# Altium schematic sheet DETECTOR.SchDoc
size A4; SheetNumber: 7; SheetTotal: 13
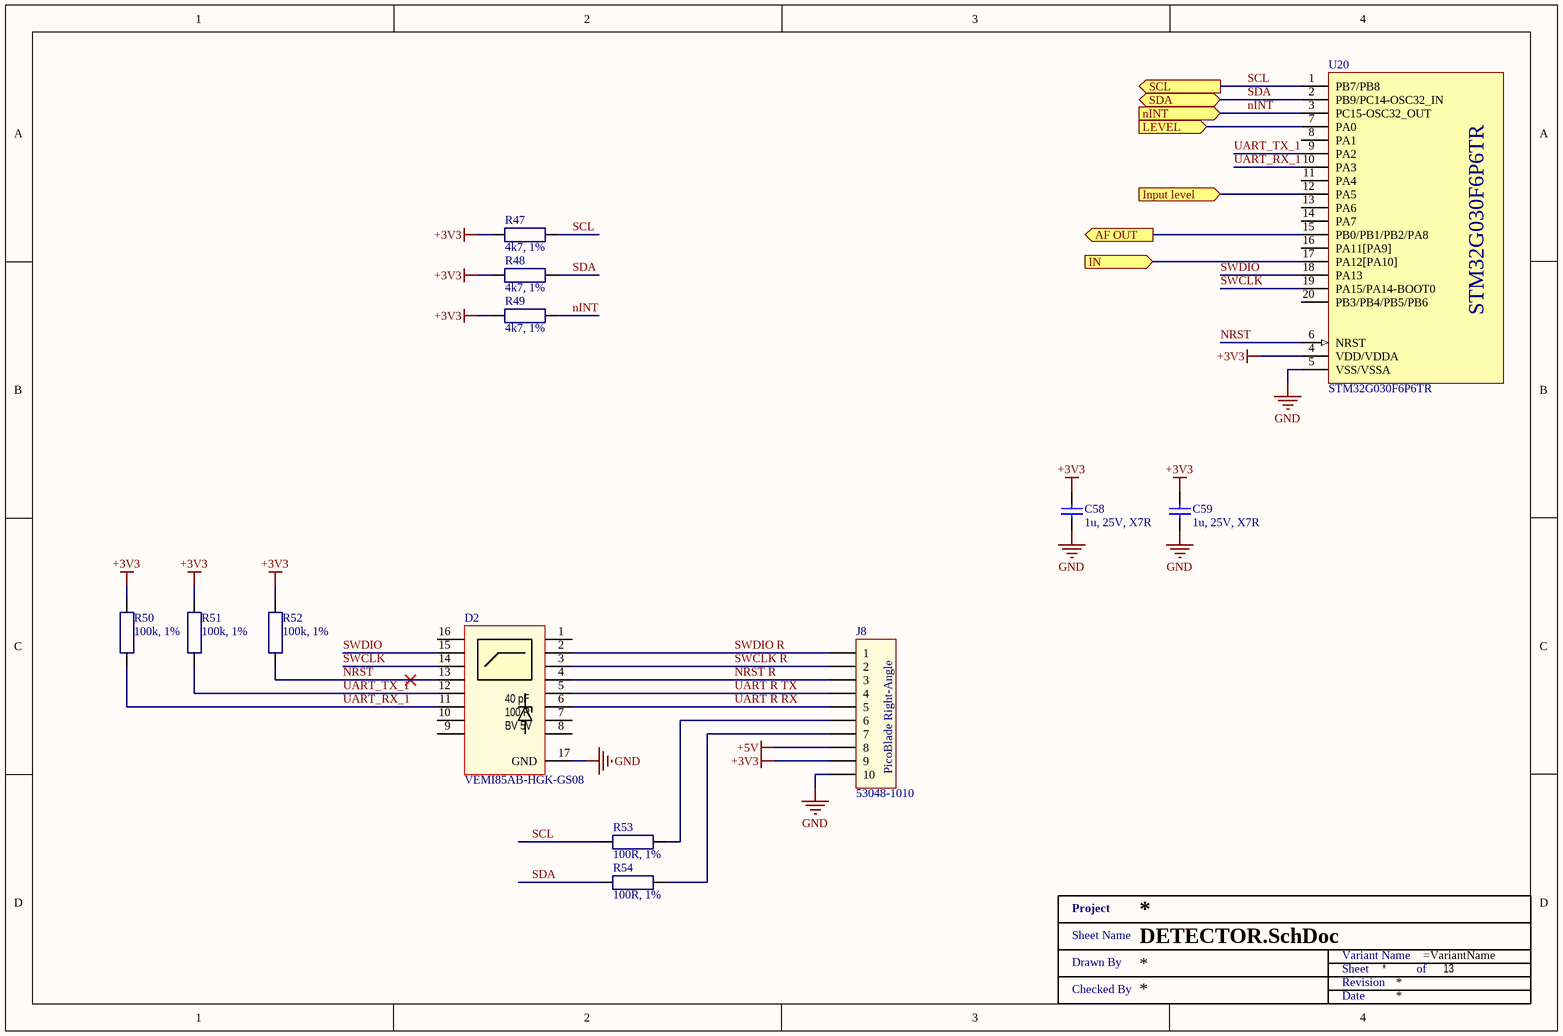
[diagram p0: DETECTOR.SchDoc]

## Parts
C58  1u, 25V, X7R  [SMD0603]
C59  1u, 25V, X7R  [SMD0603]
D2  VEMI85AB-HGK-GS08  [LLP3313-17L]
J8  53048-1010  [530481010]
R47  4k7, 1%  [SMD0603 - R]
R48  4k7, 1%  [SMD0603 - R]
R49  4k7, 1%  [SMD0603 - R]
R50  100k, 1%  [SMD0603 - R]
R51  100k, 1%  [SMD0603 - R]
R52  100k, 1%  [SMD0603 - R]
R53  100R, 1%  [SMD0603 - R]
R54  100R, 1%  [SMD0603 - R]
U20  STM32G030F6P6TR  [TSSOP20]
XX?  Title 1  (value not drawn)  (graphical)

## Ports
AF OUT (out), IN (in), Input level (in), LEVEL (in), nINT (in), SCL (out), SDA (bidir)

## Nets
+3V3: C58.2 C59.2 J8.9 R47.1 R48.1 R49.1 R50.2 R51.2 R52.2 U20.4(VDD/VDDA)
+5V: J8.8
GND: C58.1 C59.1 D2.17(GND) J8.10 U20.5(VSS/VSSA)
AF OUT: U20.15(PB0/PB1/PB2/PA8) ; port AF OUT
IN: U20.17(PA12[PA10]) ; port IN
Input level: U20.12(PA5) ; port Input level
LEVEL: U20.7(PA0) ; port LEVEL
nINT: R49.2 U20.3(PC15-OSC32_OUT) ; port nINT
NRST: D2.13 R52.1 U20.6(NRST)
NRST R: D2.4 J8.3
SCL: R47.2 R53.1 U20.1(PB7/PB8) ; port SCL
SDA: R48.2 R54.1 U20.2(PB9/PC14-OSC32_IN) ; port SDA
SWCLK: D2.14 U20.19(PA15/PA14-BOOT0)
SWCLK R: D2.3 J8.2
SWDIO: D2.15 U20.18(PA13)
SWDIO R: D2.2 J8.1
UART R RX: D2.6 J8.5
UART R TX: D2.5 J8.4
UART_RX_1: D2.11 R50.1 U20.10(PA3)
UART_TX_1: D2.12 R51.1 U20.9(PA2)
NetJ8_6: J8.6 R53.2
NetJ8_7: J8.7 R54.2

Not connected (* = marked no-connect by the designer): D2 1 7 8 9 10 16; U20 8(PA1) 11(PA4) 13(PA6) 14(PA7) 16(PA11[PA9]) 20(PB3/PB4/PB5/PB6)

## Notes on the sheet
- (in symbol 53048-1010) PicoBlade Right-Angle
- (in symbol Title 1) Project; Sheet Name; Variant Name; Drawn By; Sheet; of; Revision; Checked By; Date
- (in symbol VEMI85AB-HGK-GS08) 40 pF; 100 R; BV 5V

## Library data of the parts
C58 C59 = CGA3E1X7R1E105K080AC: CAP CER 1UF 25V X7R 0603; Manufacturer: TDK Corporation; Tolerance: ±10%; Manufacturer Part Number: CGA3E1X7R1E105K080AC; RoHS: RoHS Compliant; Category: Capacitors; Stock 1: 109509; Pricing 1: 1=0.2, 10=0.135, 100=0.0686, 500=0.04696, 1000=0.04154 (USD); Packaging: Cut Tape (CT); Part Status: Active; Voltage - Rated: 25V; Temperature Coefficient: X7R; Operating Temperature: -55°C ~ 125°C; Features: -; Ratings: AEC-Q200; Applications: Automotive; Failure Rate: -; Mounting Type: Surface Mount, MLCC; Package / Case: 0603 (1608 Metric); Size / Dimension: 0.063" L x 0.032" W (1.60mm x 0.80mm); Height - Seated (Max): -; Thickness (Max): 0.035" (0.90mm); Lead Spacing: -; Lead Style: -; ComponentLink1URL: https://product.tdk.com/info/en/catalog/datasheets/mlcc_automotive_general_en.pdf; ComponentLink1Description: https://product.tdk.com/info/en/catalog/datasheets/mlcc_automotive_general_en.pdf; Capacitance: 1u; Supplier 1: Mouser; Supplier Part Number 1: 810-CGA3E1X7R1E105K; Supplier 2: Farnell; Supplier Part Number 2: 2346962; Supplier 3: Digi-Key; Supplier Part Number 3: 445-6931-1-ND
D2 = VEMI85AB-HGK-GS08: EMI FILTER; Manufacturer: VISHAY; EMI Filter Type: EMI Filter with ESD Protection; No. of Data Lines: 8 Data Lines; Filter Circuit: C-R-C Pi Filter; Filter Case Style: LLP3313; No. of Pins: 17; Clamping Voltage Vc Max: 8; Supplier 1: Mouser; Supplier Part Number 1: 78-VEMI85AB-HGK; Manufacturer Part Number: VEMI85AB-HGK-GS08; RoHS: YES; Stock 1: 9416; Pricing 1: 1=0.563, 25=0.446, 50=0.393, 100=0.339, 250=0.308, 500=0.279 (GBP); Product Range: -; ComponentLink1URL: http://www.farnell.com/datasheets/2244016.pdf; ComponentLink1Description: http://www.farnell.com/datasheets/2244016.pdf; Supplier 2: Farnell; Supplier Part Number 2: 1795412; Supplier 3: Digi-Key; Supplier Part Number 3: 751-1456-2-ND
J8 = 53048-1010: 1.25mm Pitch, PicoBlade PCB Header, Single Row, Right-Angle, Through Hole, Tin (Sn) Plating, Friction Lock, 10 Circuits, Tray, 2.30mm PC Tail Length; Manufacturer: Molex, LLC; Pitch - Mating: 0.049" (1.25mm); Number of Positions: 10; Number of Positions Loaded: All; Style: Board to Cable/Wire; Shrouding: Shrouded - 4 Wall; Contact Length - Post: 0.091" (2.30mm); Material Flammability Rating: UL94 V-0; Manufacturer Part Number: 53048-1010; RoHS: RoHS Compliant; Category: Connectors, Interconnects; Stock 1: 6090; Pricing 1: 1=0.87, 10=0.763, 100=0.6582, 500=0.53856, 1000=0.47872, 5000=0.41888, 10000=0.39794 (USD); Packaging: Tray; Part Status: Active; Connector Type: Header; Contact Type: Male Blade; Number of Rows: 1; Row Spacing - Mating: -; Mounting Type: Through Hole, Right Angle; Termination: Solder; Fastening Type: Detent Lock; Contact Length - Mating: -; Overall Contact Length: -; Insulation Height: 0.138" (3.50mm); Contact Shape: Rectangular; Contact Finish - Mating: Tin; Contact Finish Thickness - Mating: -; Contact Finish - Post: Tin; Contact Material: Phosphor Bronze; Insulation Material: Polyamide (PA), Nylon; Features: -; Operating Temperature: -; Ingress Protection: -; Insulation Color: Natural; Current Rating: -; Voltage Rating: -; Mated Stacking Heights: -; Contact Finish Thickness - Post: -; Applications: Automotive, General Purpose, Industrial, Medical; ComponentLink1URL: http://www.molex.com/pdm_docs/sd/530481010_sd.pdf; ComponentLink1Description: http://www.molex.com/pdm_docs/sd/530481010_sd.pdf; Ucel: Ucel; Supplier 1: Mouser; Supplier Part Number 1: 538-53048-1010; Supplier 2: Digi-Key; Supplier Part Number 2: WM1750-ND; Supplier 3: Farnell; Supplier Part Number 3: 9733108
R47-R49 = CRCW06034K70FKEA: RES SMD 4.7K OHM 1% 1/10W 0603; Manufacturer: Vishay Dale; Power (Watts): 0.1W, 1/10W; Temperature Coefficient: ±100ppm/°C; Manufacturer Part Number: CRCW06034K70FKEA; RoHS: RoHS Compliant; Category: Resistors; Stock 1: 0; Pricing 1: 1=0.1, 10=0.042, 100=0.017, 1000=0.00764, 2500=0.00663 (USD); Packaging: Cut Tape (CT); Part Status: Active; Tolerance: ±1%; Composition: Thick Film; Features: Automotive AEC-Q200; Operating Temperature: -55°C ~ 155°C; Package / Case: 0603 (1608 Metric); Supplier Device Package: 0603; Size / Dimension: 0.063" L x 0.033" W (1.60mm x 0.85mm); Height - Seated (Max): 0.020" (0.50mm); Failure Rate: -; ComponentLink1URL: http://www.vishay.com/docs/20035/dcrcwe3.pdf; ComponentLink1Description: http://www.vishay.com/docs/20035/dcrcwe3.pdf; Resistance: 4k7; Supplier 1: Mouser; Supplier Part Number 1: 71-CRCW0603-4.7K-E3; Supplier 2: Farnell; Supplier Part Number 2: 1469807; Supplier 3: Digi-Key; Supplier Part Number 3: 541-4.70KHCT-ND
R50-R52 = RC0603FR-07100KL: RES SMD 100K OHM 1% 1/10W 0603; Manufacturer: Yageo; Power (Watts): 0.1W, 1/10W; Temperature Coefficient: ±100ppm/°C; Manufacturer Part Number: RC0603FR-07100KL; RoHS: RoHS Compliant; Category: Resistors; Stock 1: 14618646; Pricing 1: 1=0.1, 10=0.015, 100=0.006, 1000=0.00268, 2500=0.00233 (USD); Packaging: Cut Tape (CT); Part Status: Active; Tolerance: ±1%; Composition: Thick Film; Features: Moisture Resistant; Operating Temperature: -55°C ~ 155°C; Package / Case: 0603 (1608 Metric); Supplier Device Package: 0603; Size / Dimension: 0.063" L x 0.032" W (1.60mm x 0.80mm); Height - Seated (Max): 0.022" (0.55mm); Failure Rate: -; ComponentLink1URL: http://www.yageo.com/documents/recent/PYu-RC_Group_51_RoHS_L_8.pdf; ComponentLink1Description: http://www.yageo.com/documents/recent/PYu-RC_Group_51_RoHS_L_8.pdf; Resistance: 100k; Supplier 1: Mouser; Supplier Part Number 1: 603-RC0603FR-07100KL; Supplier 2: Farnell; Supplier Part Number 2: 9238727; Supplier 3: Digi-Key; Supplier Part Number 3: 311-100KHRCT-ND
R53 R54 = MCWR06X1000FTL: MULTICOMP - MCWR06X1000FTL - RES, THICK FILM, 100R, 1%, 0.1W, 0603; Voltage Rating: 50; Resistor Case Style: 0603 [1608 Metric]; Power Rating: 100; Product Range: MCWR Series; Temperature Coefficient: ± 100; SVHC: No SVHC (07-Jul-2017)<!--FANDB--><div class="features-and-benefits-container"><div class="features-and-benefits-desc-container"><span class="features-and-benefits-container-desc">SMD Chip Resistor, Thick Film, 100 ohm, 50 V, 0603 [1608 Metric], 100 mW, ± 1%, MCWR Series</span></div><div class="features-and-benefits-description"><span class="features-benefits-value">The MCWR06X1000FTL is a thick film Chip Resistor with 0603 chip format. The resistor is constructed in a high grade ceramic body (aluminium oxide). Internal metal electrodes are added at each end and connected by a resistive paste that is applied to the top surface of the substrate. The composition of the paste is adjusted to give the approximate resistance required and the value is trimmed to within tolerance by laser cutting of this resistive layer.</span></div><div class="features-and-benefits-list"><ul class="features-and-benefits-list-list"><li class="features-and-benefits-list-item">High reliability and stability</li><li class="features-and-benefits-list-item">Reduced size of final equipment</li><li class="features-and-benefits-list-item">Lower assembly costs</li><li class="features-and-benefits-list-item">Higher component and equipment reliability</li></ul></div><div class="features-and-benefits-applications"><ul class="features-and-benefits-value"><li class="features-and-benefits-list-item">Consumer Electronics</li><li class="features-and-benefits-list-item">Computers & Computer Peripherals</li><li class="features-and-benefits-list-item">Communications & Networking</li></ul></div></div>; Supplier 1: Farnell; Supplier Part Number 1: 2447227; Manufacturer: MULTICOMP; Manufacturer Part Number: MCWR06X1000FTL; RoHS: Y-EX; Stock 1: 246691; Pricing 1: 10=0.0032, 100=0.002, 500=0.0013, 1000=0.0011, 2500=0.0009 (GBP); Resistance: 100R; Resistance Tolerance: ± 1%; Packaging: Cut Tape; Resistor Element Material: Thick Film; Automotive Qualification Standard: -; ComponentLink1URL: http://www.farnell.com/datasheets/1849611.pdf; ComponentLink1Description: http://www.farnell.com/datasheets/1849611.pdf
U20 = STM32G030F6P6TR: MCU 32-Bit STM32 ARM Cortex-M0+ RISC 32KB Flash 2V to 3.6V 20-Pin TSSOP T/R; Manufacturer: STMicroelectronics; Supplier 1: Mouser; Supplier Part Number 1: 511-STM32G030F6P6TR; Manufacturer Part Number: STM32G030F6P6TR; RoHS: Yes; Category: Microcontrollers; Stock 1: 3310; Pricing 1: 1=1.84000, 10=1.66000, 50=1.66000, 100=1.29000, 250=1.21000, 500=1.07000, 1000=0.84100, 2500=0.78400, 5000=0.74700, 10000=0.74700 (USD); Supplier 2: Digi-Key; Supplier Part Number 2: 497-STM32G030F6P6TRCT-ND